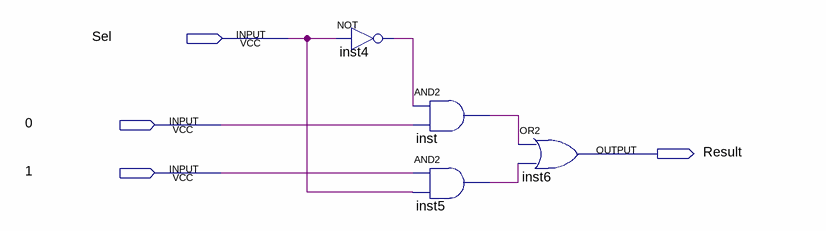
[diagram p0: schematic sheet]
// Quartus schematic Mux2t01.bdf as structural Verilog: 4 symbols, 4 pins
module Mux2t01 (
  input  Sel,
  input  \0 ,
  input  \1 ,
  output Result
);

  wire inst4_out, inst5_out, inst_out;

  not inst4 (inst4_out, Sel);
  and inst (inst_out, inst4_out, \0 );
  and inst5 (inst5_out, \1 , Sel);
  or inst6 (Result, inst_out, inst5_out);
endmodule
